# EAGLE design MICHA (EAGLE 9.2.2)
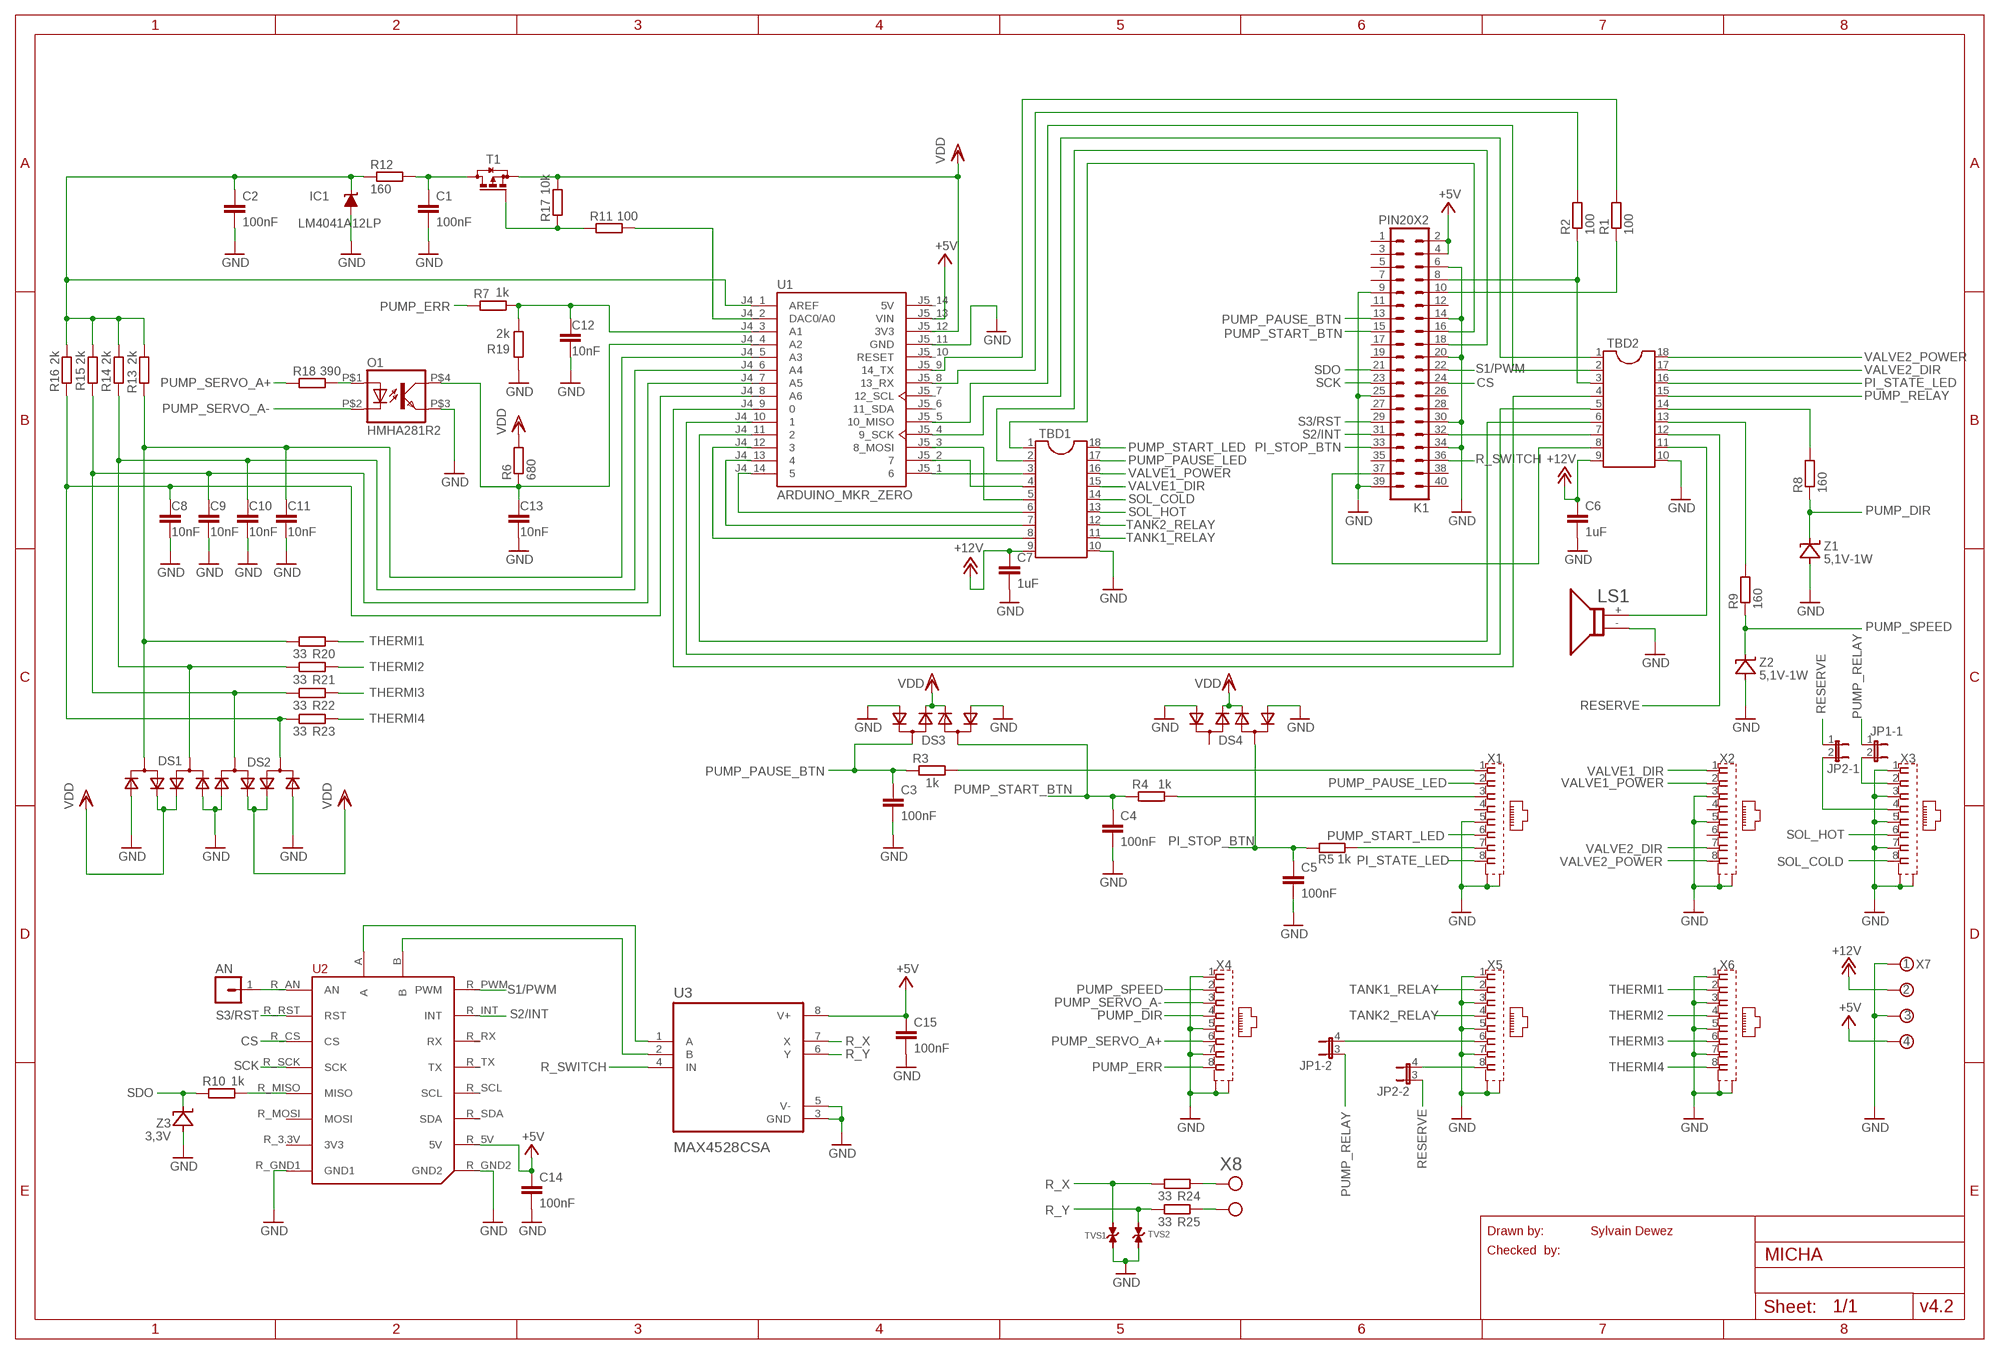
[diagram p0: schematic, sheet 1]

## Parts
AN  MA01_PINHEADER  [MA01]
C1  100nF  C-EUC1206  [C1206]
C2  100nF  C-EUC1206  [C1206]
C3  100nF  C-EUC1206  [C1206]
C4  100nF  C-EUC1206  [C1206]
C5  100nF  C-EUC1206  [C1206]
C6  1uF  C-EUC1206  [C1206]
C7  1uF  C-EUC1206  [C1206]
C8  10nF  C-EUC1206  [C1206]
C9  10nF  C-EUC1206  [C1206]
C10  10nF  C-EUC1206  [C1206]
C11  10nF  C-EUC1206  [C1206]
C12  10nF  C-EUC1206  [C1206]
C13  10nF  C-EUC1206  [C1206]
C14  100nF  C-EUC1206  [C1206]
C15  100nF  C-EUC1206  [C1206]
DS1  SDM10M45SD  [SDM10M45SD_SOT-26]
DS2  SDM10M45SD  [SDM10M45SD_SOT-26]
DS3  SDM10M45SD  [SDM10M45SD_SOT-26]
DS4  SDM10M45SD  [SDM10M45SD_SOT-26]
IC1  LM4041A12LP  [LP_O-PBCY-W3]
JP1  JP2QE  [JP2Q]
JP2  JP2QE  [JP2Q]
K1  PIN20X2  [PIN_20X2]
LS1  RSPRO-BUZZER-7800743  [RSPRO-BUZZER-7800743]
O1  HMHA281R2  [HMHA281R2]
R1  100  R-EU_R1206  [R1206]
R2  100  R-EU_R1206  [R1206]
R3  1k  R-EU_R1206  [R1206]
R4  1k  R-EU_R1206  [R1206]
R5  1k  R-EU_R1206  [R1206]
R6  680  R-EU_R1206  [R1206]
R7  1k  R-EU_R1206  [R1206]
R8  160  R-EU_R1206  [R1206]
R9  160  R-EU_R1206  [R1206]
R10  1k  R-EU_R1206  [R1206]
R11  100  R-EU_R1206  [R1206]
R12  160  R-EU_R1206  [R1206]
R13  2k  R-EU_R1206  [R1206]
R14  2k  R-EU_R1206  [R1206]
R15  2k  R-EU_R1206  [R1206]
R16  2k  R-EU_R1206  [R1206]
R17  10k  R-EU_R1206  [R1206]
R18  390  R-EU_R1206  [R1206]
R19  2k  R-EU_R1206  [R1206]
R20  33  R-EU_R1206  [R1206]
R21  33  R-EU_R1206  [R1206]
R22  33  R-EU_R1206  [R1206]
R23  33  R-EU_R1206  [R1206]
R24  33  R-EU_R1206  [R1206]
R25  33  R-EU_R1206  [R1206]
T1  BSS84  [SOT23]
TBD1  DIL18S  [SOCKET-18]
TBD2  DIL18S  [SOCKET-18]
TVS1  TVS_SOD123  [TVS_SOD123]
TVS2  TVS_SOD123  [TVS_SOD123]
U1  ARDUINO_MKR_ZERO  [MODULE_ARDUINO_MKR_ZERO]
U2  MIKROE_CLICK_UPGRADE  [MIKROE_BUS_MIDI_UPGRADE]
U3  MAX4528CSA  [SOIC127P600X175-8N]
X1  SS-7188S-A-NF_V2  [BEL_SS-7188S-A-NF]
X2  SS-7188S-A-NF_V2  [BEL_SS-7188S-A-NF]
X3  SS-7188S-A-NF_V2  [BEL_SS-7188S-A-NF]
X4  SS-7188S-A-NF_V2  [BEL_SS-7188S-A-NF]
X5  SS-7188S-A-NF_V2  [BEL_SS-7188S-A-NF]
X6  SS-7188S-A-NF_V2  [BEL_SS-7188S-A-NF]
X7  BUCHANAN_4_3.5MM  [BUCHANAN_4_3.5MM]
X8  MPT_0,5/_2-2,54_1725656_2  [PH_MPT_0,5/_2-2,54_1725656]
Z1  5,1V-1W  ZENER_SMA  [ZENER_SMA]
Z2  5,1V-1W  ZENER_SMA  [ZENER_SMA]
Z3  3,3V  ZENER_SMA  [ZENER_SMA]

## Nets
+5V: C14.1 C15.1 K1.2 K1.4 U1.J5_13(VIN) U2.R_5V(5V) U3.8(V+) X7.4(KL3)
+12V: C6.1 C7.1 TBD1.9 TBD2.9 X7.2(KL1)
CS: K1.24 U2.R_CS(CS)
D0: TBD2.4 U1.J4_9
D1: TBD2.5 U1.J4_10
D2: TBD2.6 U1.J4_11
D3: TBD1.8 U1.J4_12
D4: TBD1.7 U1.J4_13
D5: TBD1.6 U1.J4_14
D6: TBD1.3 U1.J5_1
D7: TBD1.4 U1.J5_2
D8: TBD1.5 U1.J5_3(8_MOSI)
D9: TBD2.1 U1.J5_4(9_SCK)
D10: TBD2.2 U1.J5_5(10_MISO)
D19: C12.1 R7.2 R19.2 U1.J4_3(A1)
D21: R11.2 U1.J4_2(DAC0/A0)
GND: C1.2 C2.2 C3.2 C4.2 C5.2 C6.2 C7.2 C8.2 C9.2 C10.2 C11.2 C12.2 C13.2 C14.2 C15.2 DS1.1(A2) DS1.4(A3) DS2.1(A2) DS2.4(A3) DS3.1(A2) DS3.4(A3) DS4.1(A2) DS4.4(A3) IC1.3(A) K1.6 K1.9 K1.14 K1.20 K1.25 K1.30 K1.34 K1.39 LS1.- O1.P$3(EMIT) R19.1 TBD1.10 TBD2.10 TVS1.P$2(C1) TVS2.P$2(C1) U1.J5_11(GND) U2.R_GND1(GND1) U2.R_GND2(GND2) U3.3(GND) U3.5(V-) X1.5 X1.S1(GND1) X1.S2(GND2) X2.3 X2.5 X2.S1(GND1) X2.S2(GND2) X3.1 X3.3 X3.5 X3.7 X3.S1(GND1) X3.S2(GND2) X4.1 X4.5 X4.7 X4.S1(GND1) X4.S2(GND2) X5.1 X5.3 X5.5 X5.7 X5.S1(GND1) X5.S2(GND2) X6.1 X6.3 X6.5 X6.7 X6.S1(GND1) X6.S2(GND2) X7.1(KL) X7.3(KL2) Z1.A Z2.A Z3.A
N$1: U2.B U3.2(B)
N$2: R9.2 TBD2.13
N$3: R11.1 R17.1 T1.1(G)
N$4: R8.2 TBD2.14
N$5: R4.2 X1.3
N$6: C2.1 IC1.2(C) R12.1 R13.1 R14.1 R15.1 R16.1 U1.J4_1(AREF)
N$7: O1.P$1(A) R18.2
N$8: C1.1 R12.2 T1.3(D)
N$9: C13.1 O1.P$4(COL) R6.1 U1.J4_4(A2)
N$10: U2.A U3.1(A)
N$11: C11.1 DS1.3(C1) R13.2 R20.1 U1.J4_5(A3)
N$12: C10.1 DS1.6(C) R14.2 R21.1 U1.J4_6(A4)
N$13: C9.1 DS2.3(C1) R15.2 R22.1 U1.J4_7(A5)
N$14: C8.1 DS2.6(C) R16.2 R23.1 U1.J4_8(A6)
N$15: R10.2 U2.R_MISO(MISO)
N$16: AN.1 U2.R_AN(AN)
N$17: R24.2 X8.2(KL1)
N$18: R25.2 X8.1(KL)
N$19: JP1.4 X5.6
N$20: JP1.2 X3.2
N$21: JP2.4 X5.8
N$22: JP2.2 X3.4
N$23: R3.2 X1.1
N$24: R5.2 X1.7
N$26: LS1.+ TBD2.11
PI16: K1.16 TBD1.1
PI18: K1.18 TBD1.2
PI32: K1.32 TBD2.7
PI33: K1.37 TBD2.8
PI_STATE_LED: TBD2.16 X1.8
PI_STOP_BTN: C5.1 DS4.3(C1) K1.33 R5.1
PUMP_DIR: R8.1 X4.4 Z1.C
PUMP_ERR: R7.1 X4.8
PUMP_PAUSE_BTN: C3.1 DS3.6(C) K1.13 R3.1
PUMP_PAUSE_LED: TBD1.17 X1.2
PUMP_RELAY: JP1.1 JP1.3 TBD2.15
PUMP_SERVO_A+: R18.1 X4.6
PUMP_SERVO_A-: O1.P$2(C) X4.3
PUMP_SPEED: R9.1 X4.2 Z2.C
PUMP_START_BTN: C4.1 DS3.3(C1) K1.15 R4.1
PUMP_START_LED: TBD1.18 X1.6
R_SWITCH: K1.36 U3.4(IN)
R_X: R24.1 TVS1.P$1(C) U3.7(X)
R_Y: R25.1 TVS2.P$1(C) U3.6(Y)
RESERVE: JP2.1 JP2.3 TBD2.12
RX_A: R2.2 U1.J5_8(13_RX)
RX_PI: K1.10 R1.1
S1/PWM: K1.22 U2.R_PWM(PWM)
S2/INT: K1.31 U2.R_INT(INT)
S3/RST: K1.29 U2.R_RST(RST)
SCK: K1.23 U2.R_SCK(SCK)
SDO: K1.21 R10.1 Z3.C
SOL_COLD: TBD1.14 X3.8
SOL_HOT: TBD1.13 X3.6
TANK1_RELAY: TBD1.11 X5.2
TANK2_RELAY: TBD1.12 X5.4
THERMI1: R20.2 X6.2
THERMI2: R21.2 X6.4
THERMI3: R22.2 X6.6
THERMI4: R23.2 X6.8
TX_A: R1.2 U1.J5_9(14_TX)
TX_PI: K1.8 R2.1 TBD2.3
VALVE1_DIR: TBD1.15 X2.1
VALVE1_POWER: TBD1.16 X2.2
VALVE2_DIR: TBD2.17 X2.7
VALVE2_POWER: TBD2.18 X2.8
VDD: DS1.2(A1) DS1.5(A4) DS2.2(A1) DS2.5(A4) DS3.2(A1) DS3.5(A4) DS4.2(A1) DS4.5(A4) R6.2 R17.2 T1.2(S) U1.J5_12(3V3)
Unconnected: DS4.6(C) K1.1 K1.3 K1.5 K1.7 K1.11 K1.12 K1.17 K1.19 K1.26 K1.27 K1.28 K1.35 K1.38 K1.40 U1.J5_6(11_SDA) U1.J5_7(12_SCL) U1.J5_10(RESET) U2.R_3.3V(3V3) U2.R_MOSI(MOSI) U2.R_RX(RX) U2.R_SCL(SCL) U2.R_SDA(SDA) U2.R_TX(TX) X1.4 X2.4 X2.6

## Notes on the sheet
- Drawn by: | Sylvain Dewez
- Checked  by:
- v4.2

## Power pins joined to a net without a drawn wire
5V: U1.J5_14(5V)

## Library data of the parts
AN = MA01_pinHeader:MA01_PINHEADER
C1-C15 = rcl:C-EU: CAPACITOR, European symbol; SPICEPREFIX: C
DS1-DS4 = SchottkyDiodes_SDM10M45SD:SDM10M45SD
IC1 = texas:LM4041: PRECISION MICROPOWER SHUNT VOLTAGE REFERENCE Source: http://focus.ti.com/lit/ds/slcs146e/slcs146e.pdf; OC_FARNELL: 9486119; OC_NEWARK: unknown
JP1 JP2 = jumper:JP2QE: JUMPER
K1 = FLYFISH:PIN20X2
LS1 = RSpro-buzzer-7800743:RSPRO-BUZZER-7800743: Rs pro piezo buzzer 780-0743 Diamètre: 16 mm Hauteur: 14,5 mm Empattement: 7,6 mm Diamètre trou: 0,7 mm Tension de fonctionnement: 9-15 V Courant de fonctionnement: 40 mA Résistance: 115 ohms Référence: 780-0743 Datasheet: https://docs.rs-online.com/ff3f/0900766b81582bd9.pdf
O1 = HMHA281R2:HMHA281R2
R1-R7 R10 R11 R13-R25 = resistor:R-EU_: RESISTOR, European symbol
R8 R9 R12 = rcl:R-EU_: RESISTOR, European symbol; SPICEPREFIX: R
T1 = transistor-small-signal:BSS84: P-CHANNEL MOS FET
TBD1 TBD2 = ic-package:DIL18: Dual In Line / Socket
TVS1 TVS2 = TV02W6V0B-G_SOD123:TVS_SOD123
U1 = ARDUINO_MKR_ZERO:ARDUINO_MKR_ZERO: ATSAMD21 Arduino MKR Zero with Headers SAM D ARM® Cortex®-M0+ MCU 32-Bit Embedded Evaluation Board; AVAILABILITY: Unavailable; DESCRIPTION: ATSAMD21 Arduino MKR Zero with Headers SAM D ARM® Cortex®-M0+ MCU 32-Bit Embedded Evaluation Board; MF: Arduino; MP: ARDUINO MKR ZERO; PACKAGE: None; PRICE: None
U2 = mikrobus_lib:MIKROE_CLICK_UPGRADE
U3 = MAX4528CSA:MAX4528CSA: Check prices <https://pricing.snapeda.com/parts/MAX4528CSA%2B/Maxim%20Integrated/view-part?ref=eda>; AVAILABILITY: Warning; DESCRIPTION: 2 Circuit IC Switch 2:1 110Ohm 8-SOIC; MF: Maxim Integrated; MP: MAX4528CSA+; PACKAGE: SOIC-8 Maxim; PRICE: None; PURCHASE-URL: https://pricing.snapeda.com/search/part/MAX4528CSA+/?ref=eda
X1-X6 = SS-7188S-A-NF:SS-7188S-A-NF_V2: Modular Jack | CAT5E | Horizontal (90) | 8P 8C | NF Shielded Check prices <https://pricing.snapeda.com/parts/SS-7188S-A-NF/Stewart%20Connector/view-part?ref=eda>; AVAILABILITY: Warning; DESCRIPTION: Jack Modular Connector 8p8c (RJ45, Ethernet) 90° Angle (Right) Shielded Cat5e; MF: Stewart Connector; MP: SS-7188S-A-NF; PACKAGE: None; PRICE: None; PURCHASE-URL: https://pricing.snapeda.com/search/part/SS-7188S-A-NF/?ref=eda
X7 = con-TEconnectivity:BUCHANAN_4_3.5MM
X8 = MPT_0_5__2-2_54_1725656:MPT_0,5/_2-2,54_1725656_2: Terminal block; 2.54mm; ways: 2; 6A; 125V; AVAILABILITY: Unavailable; DESCRIPTION: 2 Position Wire to Board Terminal Block Horizontal with Board 0.100 (2.54mm) Through Hole; MF: Phoenix Contact; MP: MPT 0,5/ 2-2,54 1725656; PACKAGE: None; PRICE: None
Z1-Z3 = Zener_SMA:ZENER_SMA

## Board
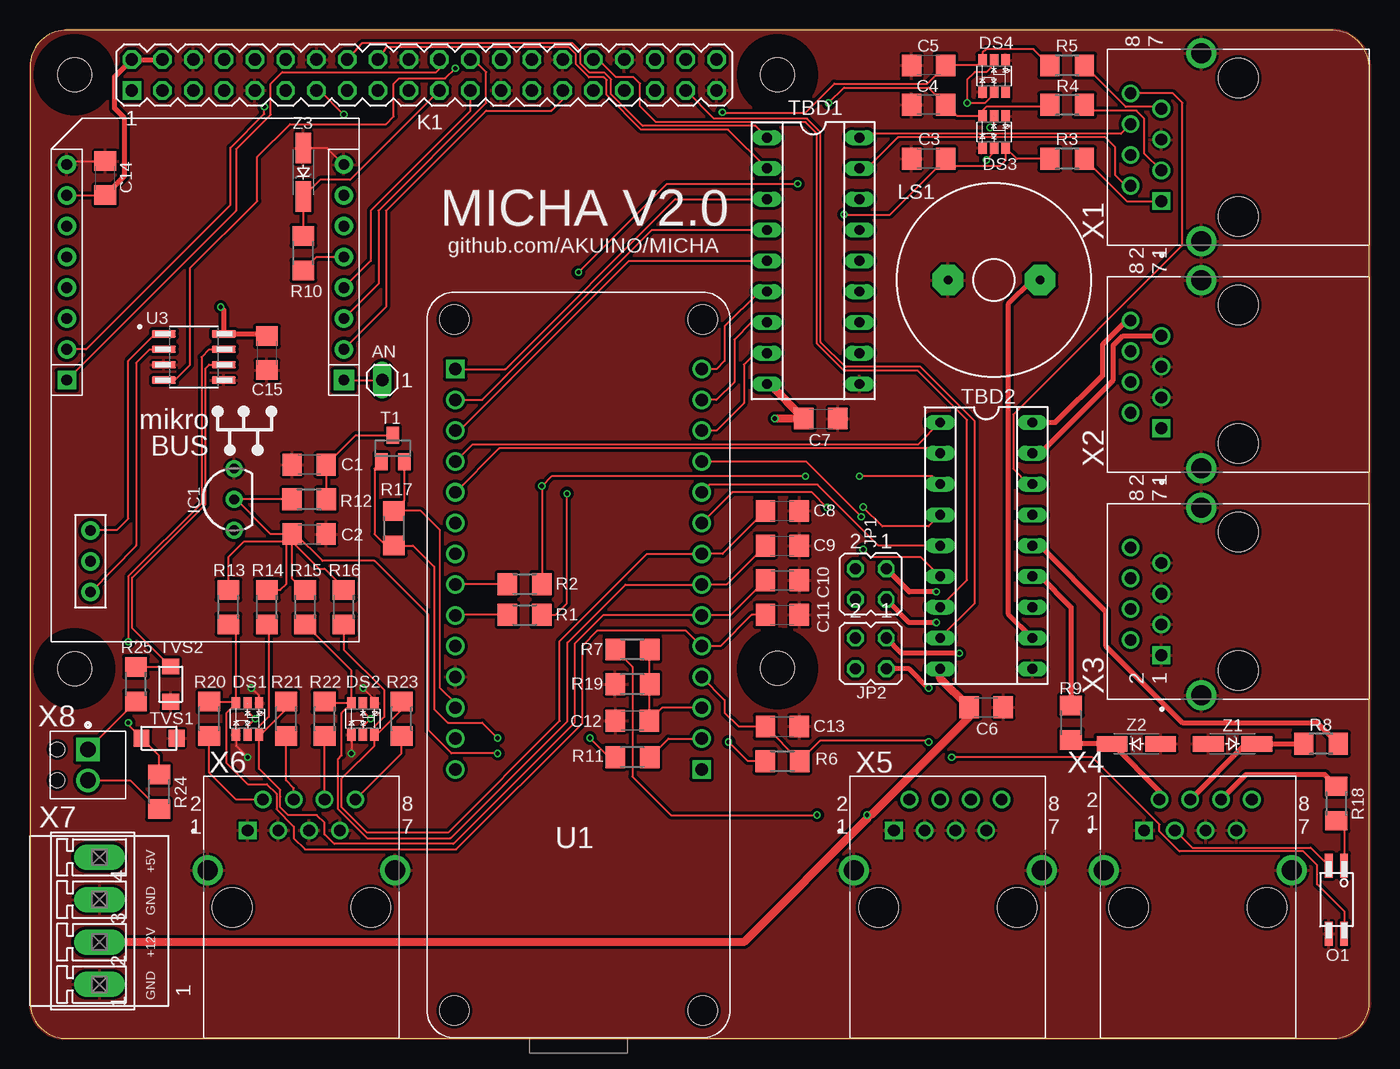
[diagram p1: board, top side]
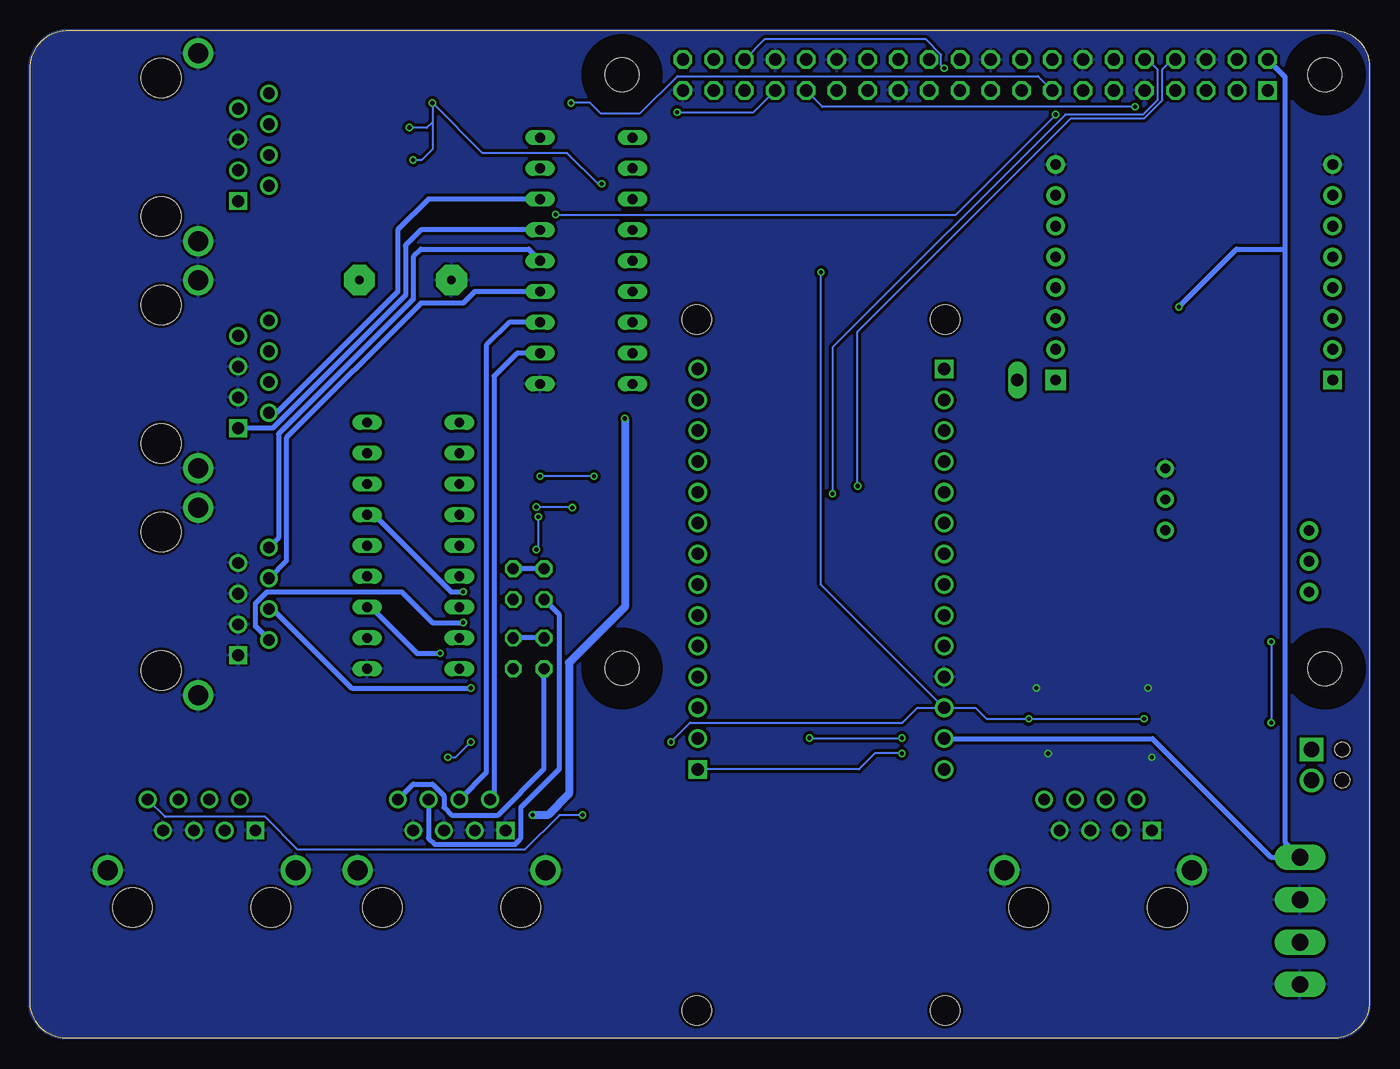
[diagram p2: board, bottom side, seen from below]

Size 110.49 x 83.15 mm. Coordinates in mm from the lower left corner, seen from the top.
Outline: 0,3 arc90 2.84,0 107.54,0 arc90 110.49,2.95 110.49,80.19 arc90 107.22,83.15 2.84,83.15 arc90 0,80.15 0,3
Copper layers (1*16): Top 0.018mm / dielectric 1.55mm / Bottom 0.018mm
Design rules "eC_2Layer_PClass6_BaseCopperO18_eCDefault *": minimum track width 6mil, minimum drill 0.35mm, track to track 0.15mm, track to pad 0.15mm, pad to pad 0.15mm, via to via 0.15mm, smd to smd 0mil, copper to edge 0mil, drill to drill 0.35mm, minimum pad ring 0.175mm, minimum via ring 0.125mm, stop-mask expansion 0mil, vias tented up to drill 0.45mm, thermal gap 0.2mm
Holes 2.8 mm at 3.65,30.49 3.65,79.49 61.65,79.49 61.65,30.51
tRestrict: area 2.1,77.9 to 5.2,81; area 60.1,77.9 to 63.2,81; area 2.1,28.9 to 5.2,32; area 60.1,29 to 63.2,32.1
bRestrict: area 2.1,28.9 to 5.2,32; area 2.1,77.9 to 5.2,81; area 60.1,77.9 to 63.2,81; area 60.1,29 to 63.2,32.1

### Footprints (pad centres in the part's own frame; a part is rotated, then mirrored left to right if it is on the bottom)
MA01 = drill 1.016 long: 1 0,0
C1206 = smd 1.6 x 1.8: 1 -1.4,0; 2 1.4,0
SDM10M45SD_SOT-26 = smd 0.69 x 0.99: 1 -0.95,-1.29; 2 0,-1.29; 3 0.95,-1.29; 4 0.95,1.3; 5 0,1.3; 6 -0.95,1.3
LP_O-PBCY-W3 = drill 0.8 pad 1.4: 1 -2.54,0; 2 0,0; 3 2.54,0
JP2Q = drill 0.914 octagon: 1 -1.27,-1.27; 2 -1.27,1.27; 3 1.27,-1.27; 4 1.27,1.27
PIN_20X2 = drill 1.016 square: 1 -24.13,-1.27 | drill 1.016 octagon: 2 -24.13,1.27; 3 -21.59,-1.27; 4 -21.59,1.27; 5 -19.05,-1.27; 6 -19.05,1.27; 7 -16.51,-1.27; 8 -16.51,1.27; 9 -13.97,-1.27; 10 -13.97,1.27; 11 -11.43,-1.27; 12 -11.43,1.27; 13 -8.89,-1.27; 14 -8.89,1.27; 15 -6.35,-1.27; 16 -6.35,1.27; 17 -3.81,-1.27; 18 -3.81,1.27; 19 -1.27,-1.27; 20 -1.27,1.27; 21 1.27,-1.27; 22 1.27,1.27; 23 3.81,-1.27; 24 3.81,1.27; 25 6.35,-1.27; 26 6.35,1.27; 27 8.89,-1.27; 28 8.89,1.27; 29 11.43,-1.27; 30 11.43,1.27; 31 13.97,-1.27; 32 13.97,1.27; 33 16.51,-1.27; 34 16.51,1.27; 35 19.05,-1.27; 36 19.05,1.27; 37 21.59,-1.27; 38 21.59,1.27; 39 24.13,-1.27; 40 24.13,1.27
RSPRO-BUZZER-7800743 = drill 0.7 pad 2.54 octagon: + 3.8,0; - -3.8,0
HMHA281R2 = smd 2 x 0.635: P$1 -2.8,0.635; P$2 -2.8,-0.635; P$3 2.8,-0.635; P$4 2.8,0.635
R1206 = smd 1.6 x 1.803: 1 -1.422,0; 2 1.422,0
SOT23 = smd 1 x 1.4: 1 -0.95,-1.1; 2 0.95,-1.1; 3 0,1.1
SOCKET-18 = drill 0.813 long: 1 -10.16,-3.81; 2 -7.62,-3.81; 3 -5.08,-3.81; 4 -2.54,-3.81; 5 0,-3.81; 6 2.54,-3.81; 7 5.08,-3.81; 8 7.62,-3.81; 9 10.16,-3.81; 10 10.16,3.81; 11 7.62,3.81; 12 5.08,3.81; 13 2.54,3.81; 14 0,3.81; 15 -2.54,3.81; 16 -5.08,3.81; 17 -7.62,3.81; 18 -10.16,3.81
TVS_SOD123 = smd 1.295 x 1.397: P$1 -1.448,0; P$2 1.448,0
MODULE_ARDUINO_MKR_ZERO = drill 1.02 square: J4_1 -8.615,-10.16; J5_1 24.405,10.16 | drill 1.02: J4_2 -6.075,-10.16; J4_3 -3.535,-10.16; J4_4 -0.995,-10.16; J4_5 1.545,-10.16; J4_6 4.085,-10.16; J4_7 6.625,-10.16; J4_8 9.165,-10.16; J4_9 11.705,-10.16; J4_10 14.245,-10.16; J4_11 16.785,-10.16; J4_12 19.325,-10.16; J4_13 21.865,-10.16; J4_14 24.405,-10.16; J5_2 21.865,10.16; J5_3 19.325,10.16; J5_4 16.785,10.16; J5_5 14.245,10.16; J5_6 11.705,10.16; J5_7 9.165,10.16; J5_8 6.625,10.16; J5_9 4.085,10.16; J5_10 1.545,10.16; J5_11 -0.995,10.16; J5_12 -3.535,10.16; J5_13 -6.075,10.16; J5_14 -8.615,10.16 | hole 2.42: -28.5,-10.25; -28.5,10.25; 28.5,10.25; 28.5,-10.25
MIKROE_BUS_MIDI_UPGRADE = drill 0.889 pad 1.524: A 22.174,33.997; B 22.174,39.077; P$18 22.174,36.537; R_3.3V 1.27,6.35; R_5V 24.13,6.35; R_CS 1.27,16.51; R_GND1 1.27,3.81; R_GND2 24.13,3.81; R_INT 24.13,19.05; R_MISO 1.27,11.43; R_MOSI 1.27,8.89; R_RST 1.27,19.05; R_RX 24.13,16.51; R_SCK 1.27,13.97; R_SCL 24.13,11.43; R_SDA 24.13,8.89; R_TX 24.13,13.97 | drill 0.889 pad 1.676 square: R_AN 1.27,21.59 | drill 0.889 pad 1.524 square: R_PWM 24.13,21.59
SOIC127P600X175-8N = smd 1.97 x 0.59: 1 -2.475,1.905; 2 -2.475,0.635; 3 -2.475,-0.635; 4 -2.475,-1.905; 5 2.475,-1.905; 6 2.475,-0.635; 7 2.475,0.635; 8 2.475,1.905
BEL_SS-7188S-A-NF = drill 0.97 square: 1 -4.445,6.35 | drill 0.97: 2 -3.175,8.89; 3 -1.905,6.35; 4 -0.635,8.89; 5 0.635,6.35; 6 1.905,8.89; 7 3.175,6.35; 8 4.445,8.89 | drill 1.65: S1 -7.745,3.05; S2 7.745,3.05 | hole 3.25: 5.715,0; -5.715,0
BUCHANAN_4_3.5MM = drill 1.397 long: 1 -5.25,0; 2 -1.75,0; 3 1.75,0; 4 5.25,0
PH_MPT_0,5/_2-2,54_1725656 = drill 1.3 square: 1 -1.27,0 | drill 1.3: 2 1.27,0 | hole 1.2: -1.27,-2.54; 1.27,-2.54
ZENER_SMA = smd 2.54 x 1.27: A 2,0; C -2,0

### Placement (x,y rotation side)
AN  29.04,54.29 180 top
C1  23.01,47.31 180 top
C2  23.01,41.59 0 top
C3  74.13,72.55 180 top
C4  74.13,76.99 180 top
C5  74.13,80.25 180 top
C6  78.89,27.3 0 top
C7  65.24,51.12 0 top
C8  62.06,43.5 0 top
C9  62.06,40.64 0 top
C10  62.06,37.78 0 top
C11  62.06,34.92 0 top
C12  49.68,26.19 180 top
C13  62.06,25.72 0 top
C14  6.18,70.96 90 top
C15  19.52,56.52 270 top
DS1  17.93,26.35 180 top
DS2  27.46,26.35 180 top
DS3  79.53,74.77 180 top
DS4  79.53,79.38 180 top
IC1  16.82,44.45 90 top
JP1  69.37,37.47 180 top
JP2  69.37,31.75 180 top
K1  32.5,79.46 0 top
LS1  79.53,62.55 0 top
O1  107.78,11.43 270 top
R1  40.79,34.92 180 top
R2  40.79,37.47 180 top
R3  85.56,72.55 0 top
R4  85.56,76.99 0 top
R5  85.56,80.25 0 top
R6  62.06,22.86 180 top
R7  49.68,32.07 0 top
R8  106.51,24.29 0 top
R9  85.88,26.04 90 top
R10  22.54,64.77 270 top
R11  49.68,23.18 0 top
R12  23.01,44.45 0 top
R13  16.34,35.56 270 top
R14  19.52,35.56 270 top
R15  22.69,35.56 270 top
R16  25.87,35.56 270 top
R17  30,42.07 90 top
R18  107.78,19.37 270 top
R19  49.68,29.21 0 top
R20  14.76,26.35 270 top
R21  21.11,26.35 270 top
R22  24.28,26.35 270 top
R23  30.63,26.35 270 top
R24  10.63,20.32 270 top
R25  8.72,29.21 270 top
T1  29.92,48.66 0 top
TBD1  64.6,64.14 270 top
TBD2  78.89,40.64 270 top
TVS1  10.63,24.77 0 top
TVS2  11.58,29.21 270 top
U1  45.24,30.8 90 top
U2  27.14,75.88 180 top
U3  13.49,56.2 0 top
X1  99.69,73.5 90 top
X2  99.69,54.77 90 top
X3  99.69,36.04 90 top
X4  96.35,10.8 0 top
X5  75.72,10.8 0 top
X6  22.38,10.8 0 top
X7  5.71,9.68 90 top
X8  4.76,22.54 270 top
Z1  99.21,24.29 180 top
Z2  91.27,24.29 0 top
Z3  22.54,71.44 90 top

### Tracks (layer width: path | path; a pad name or v marks a point on that pad's centre or on a via)
+5V  (via drill 0.35)
  Top 0.152: U2.R_5V 3.04,69.56 C14.1
  Top 0.406: v15.71,60.32 15.96,60.07 U3.8 19.33,58.1 C15.1 | C14.1 7.77,71.15 7.77,75.88 6.96,76.7 6.96,79.31 K1.2 K1.4
  Bottom 0.406: U1.J5_13 17.89,24.72 8.1,14.93 X7.4 6.96,16.18 6.96,65.09 | K1.2 6.96,79.31 6.96,65.09 | v15.71,60.32 10.95,65.09 6.96,65.09
+12V  (via drill 0.35)
  Top 0.406: C6.1 77.49,26.54
  Top 0.66: TBD1.9 60.98,53.98 C7.1 v61.43,51.12 | C6.1 75.08,29.72 TBD2.9 | 77.49,26.54 69.37,18.42 v69.05,18.42 69.05,18.1 58.89,7.93 X7.2
  Bottom 0.66: v61.43,51.12 61.43,35.59 66.04,30.98 66.04,20.16 67.78,18.42 v69.05,18.42
CS
  Top 0.152: K1.24 36.58,80.73 37.62,79.69 37.62,77.15 28.73,68.26 28.73,62.23 U2.R_CS
D0  (via drill 0.35)
  Top 0.152: v65.76,43.77 64.49,45.04 57.94,45.04 U1.J4_9 | TBD2.4 74.13,42.23 70.32,42.23 v68.73,43.82
  Bottom 0.152: v65.76,43.77 65.8,43.82 v68.73,43.82
D1
  Top 0.152: TBD2.5 70,40.64 64.97,45.68 56.03,45.68 U1.J4_10
D2  (via drill 0.35)
  Top 0.152: U1.J4_11 64.01,47.58 v68.57,43.02 | TBD2.6 73.5,39.69 69.37,39.69 v68.73,40.32
  Bottom 0.152: v68.57,43.02 68.57,40.32 v68.73,40.32
D3
  Top 0.152: TBD1.8 59.84,56.51 58.89,55.56 58.89,52.39 56.62,50.12 U1.J4_12
D4
  Top 0.152: TBD1.7 59.53,59.06 58.1,57.63 58.1,54.13 56.62,52.66 U1.J4_13
D5
  Top 0.152: TBD1.6 60.16,61.6 57.3,58.74 57.3,55.88 56.62,55.2 U1.J4_14
D6
  Top 0.152: U1.J5_1 39.21,55.2 53.22,69.21 TBD1.3
D7
  Top 0.152: U1.J5_2 37.3,52.66 51.31,66.68 TBD1.4
D8
  Top 0.152: U1.J5_3 35.39,50.12 49.41,64.14 TBD1.5
D9
  Top 0.152: TBD2.1 73.26,48.98 36.47,48.98 U1.J5_4
D10
  Top 0.152: TBD2.2 74.69,48.66 38.69,48.66 U1.J5_5
D19
  Top 0.152: R7.2 51.19,31.98 51.1,31.9 R19.2 51.08,29.19 C12.1 52.15,27.26 U1.J4_3
D21
  Top 0.152: R11.2 52.65,24.72 U1.J4_2
GND  (via drill 0.35)
  Top 0.152: DS2.1 28.41,27.94 v27.46,28.89 | DS2.4 v26.5,23.49 | DS1.4 16.98,24.13 v17.93,23.18 | DS1.1 18.88,28.26 v18.25,28.89 | U2.R_GND1 24.5,73.44 Z3.A | U2.R_GND2 3.3,72.36 C14.2
  pour Bottom (isolate 0.254): 0,2.84 arc90 2.84,0 107.54,0 arc90 110.55,3.02 110.55,79.99 arc90 107.4,83.15 3.32,83.15 arc90 0,79.83
  pour Top (isolate 0.254): 0,2.84 arc90 2.84,0 107.73,0 arc90 110.55,3.15 110.55,79.99 arc90 107.4,83.15 3.32,83.15 arc90 0,79.83
N$1
  Top 0.152: U2.B 8.72,40.64 8.72,55.72 9.84,56.83 U3.2
N$2
  Top 0.406: TBD2.13 83.34,38.1 85.88,35.56 R9.2
N$3  (via drill 0.35)
  Top 0.152: v46.19,24.76 47.78,23.18 R11.1 | v38.57,24.76 37.3,26.03 34.44,26.03 33.33,27.15 33.33,38.9 31.59,40.65 R17.1 29.36,40.65 28.41,41.59 28.41,47 T1.1
  Bottom 0.152: v46.19,24.76 v38.57,24.76
N$4
  Top 0.406: TBD2.14 83.34,40.64 88.73,35.24 88.73,32.38 95.09,26.03 106.19,26.03 R8.2
N$5
  Top 0.152: R4.2 87.46,76.52 91.28,76.52 91.91,75.88 91.91,73.03 X1.3
N$6  (via drill 0.35)
  Top 0.152: v38.57,23.49 34.76,23.49 32.86,25.4 32.86,34.93 28.41,39.37 24.12,39.37 21.9,41.59 C2.1 | R12.1 16.98,44.45 | 16.98,44.45 IC1.2 | C2.1 19.84,41.59 16.98,44.45 | C2.1 20.98,40.96 17.61,40.96 16.34,39.69 R13.1 | C2.1 21.11,41.09 21.11,37.46 20.62,36.98 R14.1 | C2.1 21.58,41.56 21.58,37.94 22.54,36.98 R15.1 | C2.1 21.61,40.96 23.84,38.74 24.28,38.74 25.87,37.15 R16.1
  Bottom 0.152: v38.57,23.49 40.79,23.49 42.11,22.18 U1.J4_1
N$7
  Top 0.152: R18.2 108.42,17.31 O1.P$1
N$8
  Top 0.152: R12.2 24.43,47.29 C1.1 26.86,49.76 T1.3
N$9  (via drill 0.35)
  Top 0.152: v76.03,23.18 87.65,23.18 93.18,17.65 93.18,17.07 94.83,15.42 105.07,15.42 106.2,14.29 106.2,12.7 108.42,10.48 O1.P$4 | v74.13,24.45 74.05,24.53 65.16,24.53 R6.1 63.49,22.9 C13.1 58.44,25.72 57.3,26.86 57.3,27.9 U1.J4_4
  Bottom 0.152: v76.03,23.18 75.4,23.18 v74.13,24.45
N$10
  Top 0.152: U2.A 7.14,41.91 8.09,42.86 8.09,55.88 10.31,58.1 U3.1
N$11
  Top 0.152: C11.1 59.53,34.93 56.94,32.34 U1.J4_5 54.08,33.66 46.82,33.66 45.56,32.38 45.56,25.99 35.14,15.58 22.67,15.58 21.74,16.51 21.74,17.46 20.31,18.89 20.31,20.16 19.52,20.96 17.93,20.96 16.19,22.7 16.19,26.85 DS1.3 | R20.1 16.85,27.77 DS1.3 | DS1.3 16.98,33.5 R13.2
N$12
  Top 0.152: C10.1 57.76,34.88 U1.J4_6 47.26,34.88 44.92,32.54 44.92,26.03 34.92,16.03 25.08,16.03 24.28,16.83 24.28,17.78 23.65,18.42 21.27,18.42 20.63,19.05 20.63,19.92 20.63,20.48 18.88,22.23 DS1.6 | DS1.6 19.02,25.05 21.11,27.14 R21.1 | DS1.6 18.89,25.72 19.68,26.51 19.68,33.98 R14.2
N$13
  Top 0.152: C9.1 57.45,37.42 U1.J4_7 49.1,37.42 44.32,32.64 44.32,26.15 34.67,16.51 27.77,16.51 25.39,18.89 25.39,19.45 25.39,23.02 25.71,23.34 25.71,26.85 DS2.3 | DS2.3 24.41,27.64 R22.1 | DS2.3 26.5,30.33 R15.2
N$14
  Top 0.152: C8.1 57.13,39.96 U1.J4_8 55.38,39.95 50.88,39.95 43.7,32.76 43.7,26.19 34.47,16.97 27.79,16.97 25.71,19.05 25.71,21.43 28.41,24.13 DS2.6 | DS2.6 28.57,25.05 30.63,27.12 R23.1 | R16.2 25.87,32.07 29.2,28.73 29.2,26.51 28.41,25.72 DS2.6
N$15
  Top 0.152: R10.2 23.64,64.45 U2.R_MISO
N$16
  Top 0.152: U2.R_AN AN.1
N$17
  Top 0.152: X8.2 8.26,21.27 R24.2
N$18
  Top 0.152: X8.1 R25.2
N$19
  Bottom 0.406: JP1.4 66.83,34.93 66.83,22.22 70,19.05 70,16.51 70.19,16.32 70.19,16.27 70.48,15.99 77.1,15.99 77.62,16.51 X5.6
N$20  (via drill 0.35)
  Top 0.406: v74.76,34.29 72.54,34.29 JP1.2
  Bottom 0.406: X3.2 91.91,33.97 91.91,35.88 90.96,36.83 79.84,36.83 77.31,34.29 v74.76,34.29
N$21
  Bottom 0.406: X5.8 78.89,20.96 77.31,20.96 76.35,20 76.35,19.05 75.72,18.42 71.91,18.42 68.1,22.22 JP2.4
N$22  (via drill 0.35)
  Top 0.406: v74.13,28.89 72.54,30.48 JP2.2
  Bottom 0.406: X3.4 90.48,35.4 83.97,28.89 v74.13,28.89
N$23
  Top 0.152: R3.2 90.47,69.06 X1.1
N$24
  Top 0.152: X1.7 93.18,76.83 90.4,76.83 R5.2
N$26
  Top 0.406: LS1.+ 82.7,62.55 80.69,60.53 80.69,35.04 TBD2.11
PI16
  Top 0.152: TBD1.1 59.83,75.26 50.54,75.26 47.94,77.86 47.94,79.1 47.39,79.66 46.15,79.66 45.4,80.4 45.4,81.43 44.76,82.07 27.35,82.07 K1.16
PI18
  Top 0.152: TBD1.2 57.59,74.96 50.41,74.96 47.56,77.82 47.56,79.06 47.34,79.27 46.1,79.27 45.02,80.36 45.02,81.18 44.44,81.76 29.37,81.76 K1.18
PI32
  Top 0.152: TBD2.7 77.31,37.78 77.31,51 73.23,55.08 67.15,55.08 64.92,57.31 64.92,74.61 63.97,75.57 51.64,75.57 50.32,76.88 50.32,78.74 49.76,79.3 48.33,79.3 46.9,80.73 K1.32
PI33
  Top 0.152: TBD2.8 77.94,35.88 77.94,50.91 73.47,55.38 67.28,55.38 65.22,57.43 65.22,74.74 64.1,75.87 56.41,75.87 K1.37
PI_STATE_LED
  Top 0.152: TBD2.16 82.39,45.72 81.12,46.99 81.12,51.44 95.09,65.4 95.09,77.15 94.29,77.95 X1.8
PI_STOP_BTN  (via drill 0.35)
  Top 0.152: v57.11,76.39 57.11,76.31 63.92,76.31 66.35,78.74 74.02,78.74 C5.1 78.16,80.25 DS4.3 78.58,81.28 78.89,81.6 82.79,81.6 R5.1
  Bottom 0.152: v57.11,76.39 50.81,76.39 K1.33
PUMP_DIR
  Top 0.406: X4.4 100.32,24.29 Z1.C R8.1
PUMP_ERR  (via drill 0.35)
  Top 0.152: R7.1 49.68,30.65 49.68,21.59 52.86,18.42 v64.92,18.42
  Bottom 0.152: v64.92,18.42 66.83,18.42 69.68,15.56 88.42,15.56 91.12,18.26 99.37,18.26 X4.8
PUMP_PAUSE_BTN  (via drill 0.35)
  Top 0.152: v25.87,76.2 23.88,78.19 K1.13 | v67.15,67.95 70.95,67.95 75.56,72.55 | R3.1 81.4,72.55 DS3.6 80.48,72.39 80,71.91 76.35,71.91 75.72,72.55 75.56,72.55 | 75.56,72.55 C3.1
  Bottom 0.152: v67.15,67.95 34.12,67.95 v25.87,76.2
PUMP_PAUSE_LED
  Top 0.152: TBD1.17 69.05,71.75 71.61,74.31 88.72,74.31 89.53,73.5 89.53,71.2 90.4,70.33 X1.2
PUMP_RELAY  (via drill 0.35)
  Top 0.406: v74.76,36.83 72.54,36.83 JP1.1
  Bottom 0.406: TBD2.15 82.13,43.18 75.78,36.83 v74.76,36.83 | JP1.3 JP1.1
PUMP_SERVO_A+
  Top 0.406: R18.1 106.83,21.74 100.32,21.74 X4.6
PUMP_SERVO_A-
  Top 0.152: X4.3 95.88,15.72 105.66,15.72 O1.P$2
PUMP_SPEED
  Top 0.406: X4.2 93.18,20.38 Z2.C 86.2,24.29 R9.1
PUMP_START_BTN  (via drill 0.35)
  Top 0.152: 75.54,77.01 C4.1 | v65.87,77.15 67.15,78.42 74.13,78.42 75.54,77.01 | R4.1 83.98,76.83 78.89,76.83 78.57,76.52 78.58,76.52 DS3.3 76.49,76.06 75.54,77.01
  Bottom 0.152: K1.15 27.34,79.38 57.1,79.38 60.16,76.31 63.44,76.31 64.29,77.15 v65.87,77.15
PUMP_START_LED
  Top 0.152: X1.6 90.01,74.61 68.73,74.61 TBD1.18
R_SWITCH  (via drill 0.35)
  Top 0.152: v35.08,80.01 34.24,79.18 30.43,79.18 30,78.74 30,76.04 29.36,75.41 21.43,75.41 18.73,72.71 18.73,69.06 13.17,63.5 13.17,55.53 11.93,54.29 U3.4
  Bottom 0.152: v35.08,80.01 35.32,80.26 35.32,81.14 36.58,82.39 49.89,82.39 K1.36
R_X  (via drill 0.35)
  Top 0.152: v8.09,32.7 8.09,38.1 14.12,44.13 14.12,56.2 14.76,56.83 U3.7 | R24.1 10.63,23.32 TVS1.P$1 8.09,25.86 v8.09,26.03
  Bottom 0.152: v8.09,32.7 v8.09,26.03
R_Y
  Top 0.152: R25.1 8.75,30.66 TVS2.P$1 8.41,33.83 8.41,37.99 14.44,44.02 14.44,55.25 14.76,55.56 U3.6
RESERVE  (via drill 0.35)
  Top 0.406: v76.67,31.75 71.91,31.75 JP2.1
  Bottom 0.406: TBD2.12 82.39,35.56 78.57,31.75 v76.67,31.75 | JP2.3 JP2.1
RX_A
  Top 0.152: R2.2 35.12,37.46 U1.J5_8
RX_PI  (via drill 0.35)
  Top 0.152: R1.1 43.33,34.93 44.29,35.88 v44.29,44.92
  Bottom 0.152: K1.10 18.3,80.73 17.45,79.88 17.45,77.43 18.68,76.2 25.08,76.2 44.29,56.99 v44.29,44.92
S1/PWM
  Top 0.152: K1.22 33.77,79.97 33.49,79.69 20.79,79.69 19.84,78.74 19.84,76.2 16.98,73.34 16.98,68.26 U2.R_PWM
S2/INT  (via drill 0.35)
  Top 0.152: v19.31,76.83 19.31,76.26 16.52,73.47 16.52,68.75 4.6,56.83 U2.R_INT
  Bottom 0.152: v19.31,76.83 45.12,76.83 K1.31
S3/RST
  Top 0.152: K1.29 43.93,77.43 43.01,76.52 37.62,76.52 29.36,68.26 29.36,60.32 U2.R_RST
SCK
  Top 0.152: K1.23 36.31,76.48 28.09,68.26 28.09,64.14 U2.R_SCK
SDO
  Top 0.152: K1.21 29.62,74.04 29.56,73.98 26.39,70.8 23.9,70.8 Z3.C R10.1
SOL_COLD
  Bottom 0.406: TBD1.14 69.37,65.09 78.26,65.09 78.89,64.45 78.89,60.96 90.01,49.85 90.01,41.27 X3.8
SOL_HOT
  Bottom 0.406: TBD1.13 73.81,61.6 74.76,60.64 78.26,60.64 89.37,49.53 89.37,39.37 X3.6
TANK1_RELAY
  Bottom 0.406: TBD1.11 70.32,56.51 72.23,54.61 72.23,20 X5.2
TANK2_RELAY
  Bottom 0.406: TBD1.12 70.95,59.06 72.86,57.15 72.86,21.91 X5.4
THERMI1
  Top 0.152: X6.2 16.98,19.68 14.76,21.91 R20.2
THERMI2
  Top 0.152: X6.4 21.74,20.64 21.11,21.27 R21.2
THERMI3
  Top 0.152: X6.6 R22.2
THERMI4
  Top 0.152: X6.8 30.63,23.49 R23.2
TX_A
  Top 0.152: R1.2 35.12,34.93 U1.J5_9
TX_PI  (via drill 0.35)
  Top 0.152: TBD2.3 74.45,46.35 v68.42,46.35 | v63.97,46.35 43.01,46.35 v42.21,45.55 R2.1
  Bottom 0.152: v42.21,45.55 42.21,58.27 24.6,75.88 18.57,75.88 17.06,77.39 17.06,79.93 16.26,80.73 K1.8 | v63.97,46.35 v68.42,46.35
VALVE1_DIR
  Bottom 0.406: TBD1.15 78.26,66.68 79.53,65.4 79.53,61.28 90.48,50.32 X2.1
VALVE1_POWER
  Bottom 0.406: TBD1.16 77.62,69.21 80.16,66.68 80.16,61.6 90.16,51.59 X2.2
VALVE2_DIR
  Top 0.406: TBD2.17 83.34,48.26 89.37,54.29 89.37,57.15 90.16,57.94 X2.7
VALVE2_POWER
  Top 0.406: TBD2.18 84.61,50.8 88.5,54.69 88.5,57.24 90.47,59.21 X2.8
VDD  (via drill 0.35)
  Top 0.152: U1.J5_12 35.08,27.62 33.81,28.89 33.81,41.91 32.22,43.5 30,43.5 | R17.2 30,43.5 | R6.2 59.21,22.86 v57.62,24.45 | T1.2 30.87,44.36 30,43.5 | DS2.2 27.46,26.99 v28.09,26.35 27.46,25.72 DS2.5 | DS1.2 17.93,26.99 v18.57,26.35 17.93,25.72 DS1.5 | v45.24,63.18 52.54,70.49 v63.33,70.49 | DS4.5 79.53,77.87 78.81,77.15 v77.31,77.15 77.31,79.06 77.94,79.69 78.89,79.69 79.53,80.33 DS4.2 | v79.21,75.14 79.53,75.46 DS3.2 | v78.89,72.44 79.53,73.07 DS3.5
  Bottom 0.152: U1.J5_12 37.3,27.26 38.53,26.03 56.03,26.03 v57.62,24.45 | U1.J5_12 32.49,27.26 31.59,26.35 v28.09,26.35 v18.57,26.35 | U1.J5_12 45.24,37.42 v45.24,63.18 | v63.33,70.49 63.65,70.49 66.19,73.03 73.18,73.03 v77.31,77.15 77.31,75.57 | 77.31,75.57 77.78,75.09 79.21,75.09 v79.21,75.14 | 77.31,75.57 77.31,73.34 78.21,72.44 v78.89,72.44

### Text on the board
tNames: 8 / 7 | MICHA V2.0 | github.com/AKUINO/MICHA | 2 / 1 | 8 / 7 | 2 / 1 | 8 / 7 | 2 / 1 | 2 / 1 | 8 / 7 | 2 / 1 | 8 / 7 | 2 / 1 | 8 / 7 | +5V | GND | +12V | 1 | GND